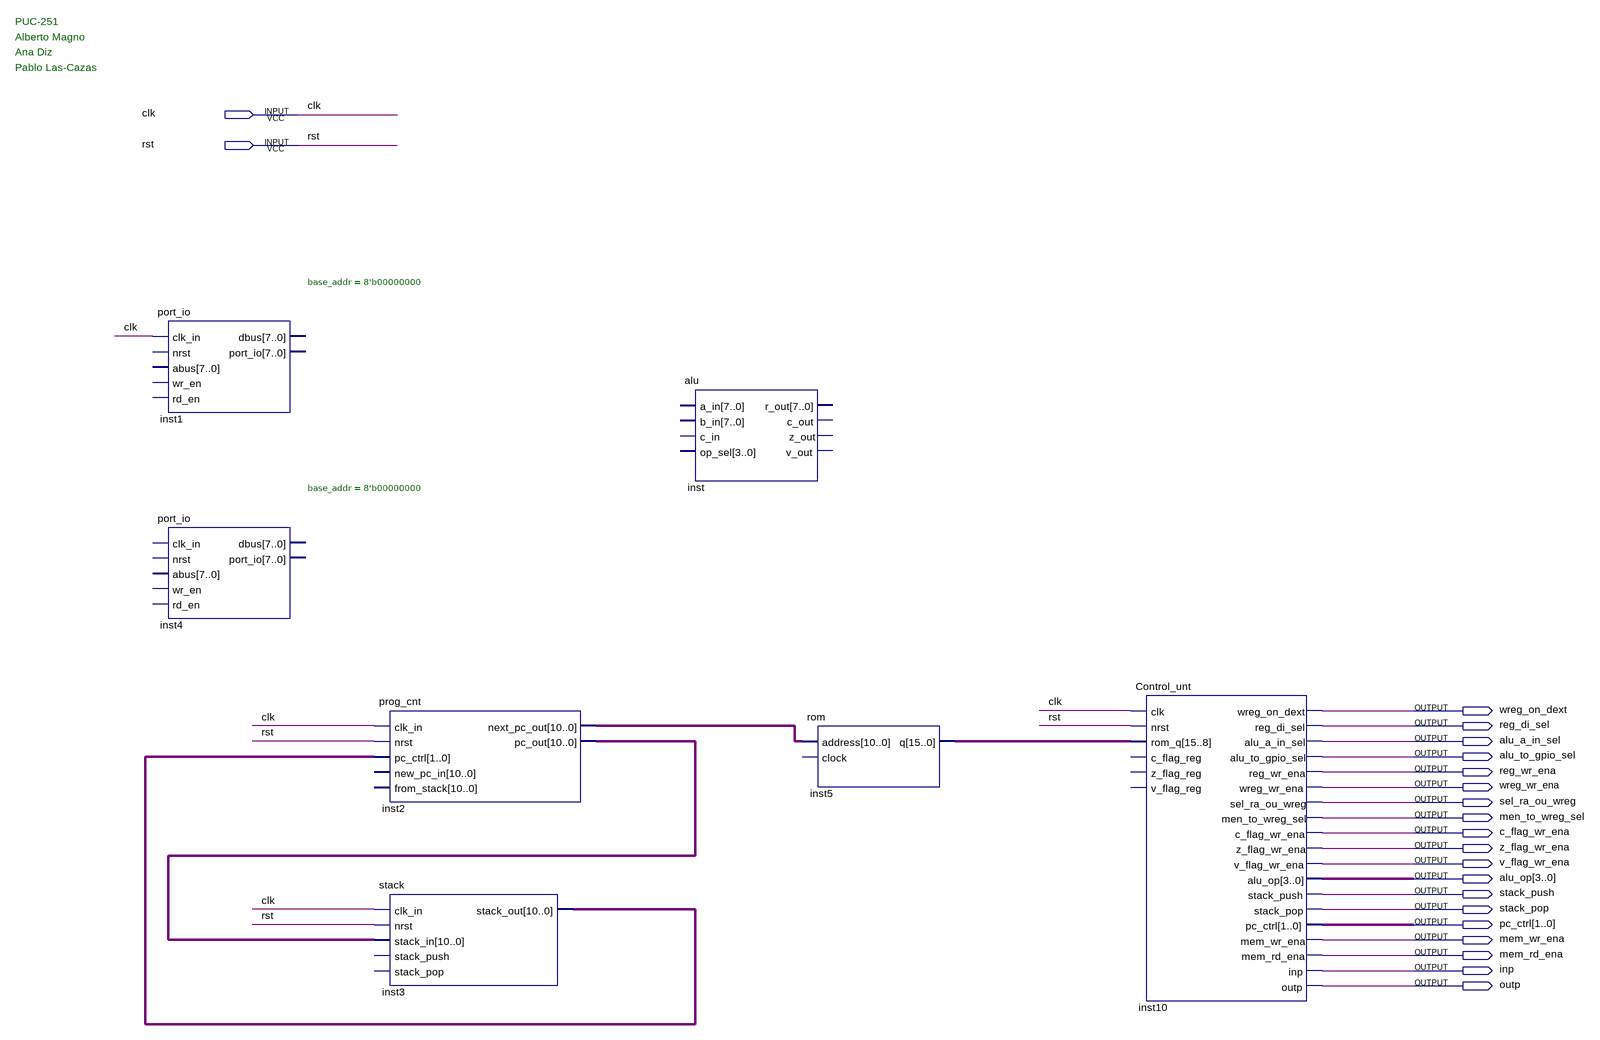
[diagram p0: schematic sheet]
// Quartus schematic PUC-251.bdf as structural Verilog: 7 symbols, 21 pins
module \PUC-251  (
  input  clk,
  input  rst,
  output wreg_on_dext,
  output reg_di_sel,
  output alu_a_in_sel,
  output alu_to_gpio_sel,
  output reg_wr_ena,
  output wreg_wr_ena,
  output sel_ra_ou_wreg,
  output men_to_wreg_sel,
  output c_flag_wr_ena,
  output z_flag_wr_ena,
  output v_flag_wr_ena,
  output [3:0] alu_op,
  output stack_push,
  output stack_pop,
  output [1:0] pc_ctrl,
  output mem_wr_ena,
  output mem_rd_ena,
  output inp,
  output outp
);

  wire [10:0] inst2_next_pc_out, inst2_pc_out, inst3_stack_out;
  wire [15:0] inst5_q;

  port_io #(.base_addr(8'b00000000)) inst1 (.clk_in(clk));  // open: nrst, abus, wr_en, rd_en, dbus, port_io
  port_io #(.base_addr(8'b00000000)) inst4 ();  // open: clk_in, nrst, abus, wr_en, rd_en, dbus, port_io
  prog_cnt inst2 (
    .clk_in(clk), .nrst(rst), .pc_ctrl(inst3_stack_out), .next_pc_out(inst2_next_pc_out),
    .pc_out(inst2_pc_out));  // open: new_pc_in, from_stack
  stack inst3 (
    .clk_in(clk), .nrst(rst), .stack_in(inst2_pc_out), .stack_out(inst3_stack_out));  // open: stack_push, stack_pop
  alu inst ();  // open: a_in, b_in, c_in, op_sel, r_out, c_out, z_out, v_out
  rom inst5 (.address(inst2_next_pc_out), .q(inst5_q));  // open: clock
  Control_unt inst10 (
    .clk(clk), .nrst(rst), .rom_q(inst5_q), .wreg_on_dext(wreg_on_dext), .reg_di_sel(reg_di_sel),
    .alu_a_in_sel(alu_a_in_sel), .alu_to_gpio_sel(alu_to_gpio_sel), .reg_wr_ena(reg_wr_ena),
    .wreg_wr_ena(wreg_wr_ena), .sel_ra_ou_wreg(sel_ra_ou_wreg), .men_to_wreg_sel(men_to_wreg_sel),
    .c_flag_wr_ena(c_flag_wr_ena), .z_flag_wr_ena(z_flag_wr_ena), .v_flag_wr_ena(v_flag_wr_ena),
    .alu_op(alu_op), .stack_push(stack_push), .stack_pop(stack_pop), .pc_ctrl(pc_ctrl),
    .mem_wr_ena(mem_wr_ena), .mem_rd_ena(mem_rd_ena), .inp(inp), .outp(outp));  // open: c_flag_reg, z_flag_reg, v_flag_reg

  // Notes on the sheet:
  //   PUC-251
  //   Alberto Magno
  //   Ana Diz
  //   Pablo Las-Cazas
endmodule
